# Altium project Tramdo.PrjPcb
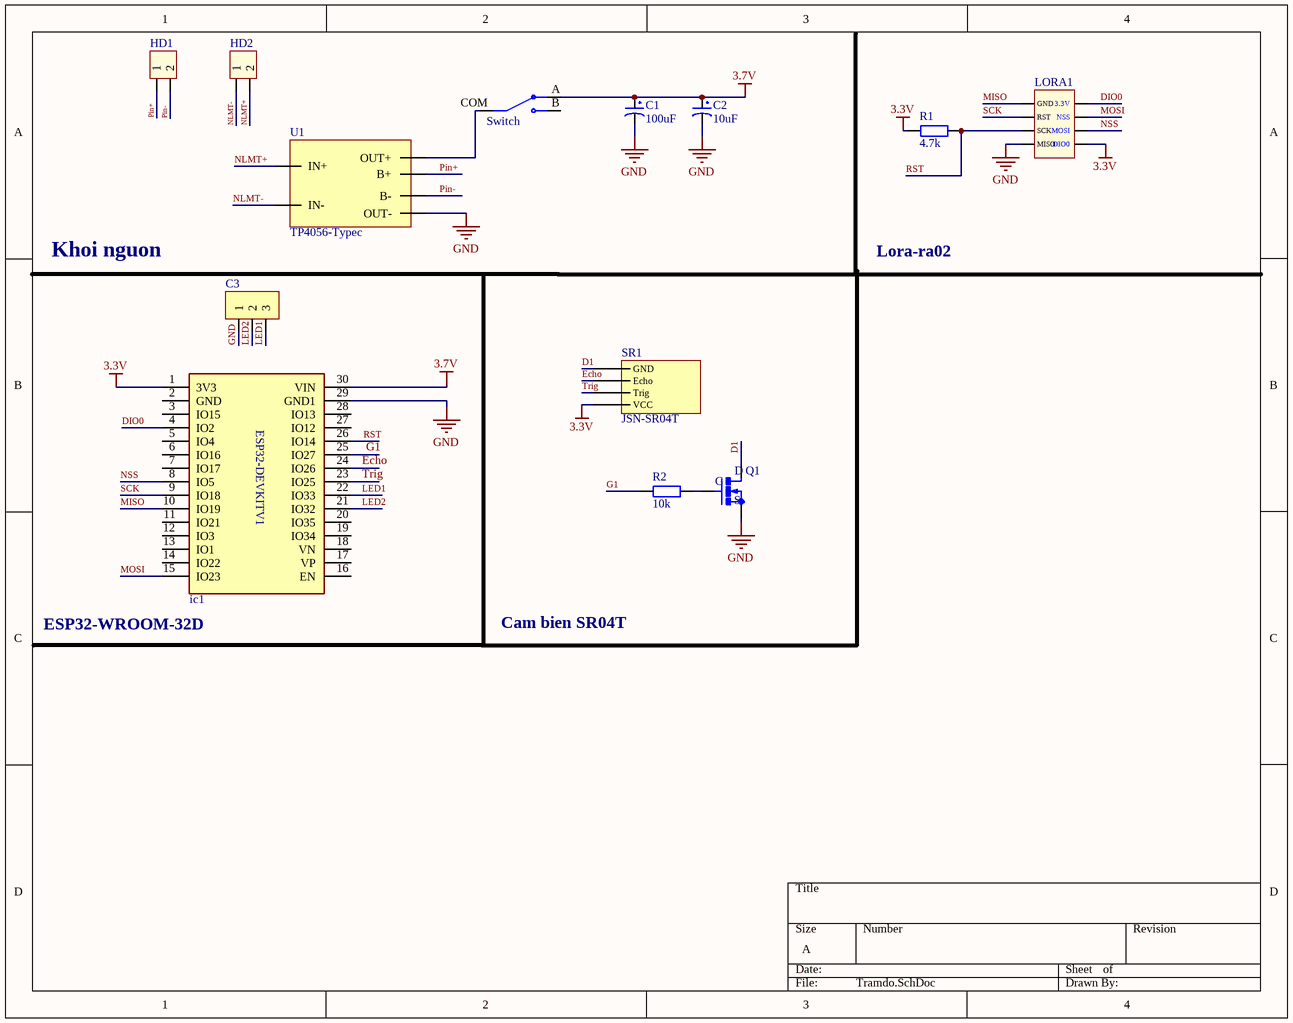
[diagram p0: Tramdo.SchDoc]
1 sheet, 13 parts. Net scope: global (net labels, ports and power ports of the same name join across sheets).
Board file: Tramdo.PcbDoc

## Sheet Tramdo.SchDoc
size A; SheetNumber: 1; SheetTotal: 1

### Parts
C1  100uF  [tu hoa 5mm]
C2  10uF  [tu hoa 4mm]
C3  JP3  [JP3-C1T]  (value not drawn)
HD1  Header 2  [HED2]  (value not drawn)
HD2  Header 2  [HED2]  (value not drawn)
ic1  ESP32 DevKit 30Pin  [ESP32 DevKit V1 30Pin CAo]  (value not drawn)
LORA1  Connector 4x2  [Lora-ra02]  (value not drawn)
Q1  2N7000  [TO92]  (value not drawn)
R1  4.7k  [tro vach 1/4w]
R2  10k  [tro vach 1/4w]
S1  Switch  [SW_R1966ABLKBLKFR]
SR1  JSN-SR04T  [JSN-SR04T]
U1  TP4056-Typec  [TP4056]

### Nets
3.3V: ic1.1(3V3) LORA1.8(DIO0) R1.1 SR1.VCC
3.7V: C1.1 C2.1 ic1.30(VIN) S1.A(6A)
GND: C1.2 C2.2 C3.1 ic1.29(GND1) LORA1.4(MISO) Q1.1(S) U1.OUT-
D1: Q1.3(D) SR1.GND
DIO0: ic1.4(IO2) LORA1.5(3.3V)
Echo: ic1.24(IO26) SR1.Echo
G1: ic1.25(IO27) R2.1
LED1: C3.3 ic1.22(IO33)
LED2: C3.2 ic1.21(IO32)
MISO: ic1.10(IO19) LORA1.1(GND)
MOSI: ic1.15(IO23) LORA1.6(NSS)
NLMT+: HD2.2 U1.IN+
NLMT-: HD2.1 U1.IN-
NSS: ic1.8(IO5) LORA1.7(MOSI)
Pin+: HD1.1 U1.B+
Pin-: HD1.2 U1.B-
RST: ic1.26(IO14) LORA1.3(SCK) R1.2
SCK: ic1.9(IO18) LORA1.2(RST)
Trig: ic1.23(IO25) SR1.Trig
NetQ1_2: Q1.2(G) R2.2
NetS1_COM: S1.COM U1.OUT+

Not connected (* = marked no-connect by the designer): ic1 2(GND) 3(IO15) 5(IO4) 6(IO16) 7(IO17) 11(IO21) 12(IO3) 13(IO1) 14(IO22) 16(EN) 17(VP) 18(VN) 19(IO34) 20(IO35) 27(IO12) 28(IO13); S1 B(6A)

### Notes on the sheet
- Khoi nguon
- Lora-ra02
- (near ic1) ESP32-WROOM-32D
- Cam bien SR04T
- (in symbol ESP32 DevKit 30Pin) ESP32-DEVKITV1

### Library data of the parts
C1 = Tu Hoa 100uF 16V 5x11: Cắm; Don_Vi: Con; So_Chan: 2; Ten_Linh_Kien: Tụ Hóa 100uF 16V 5x11MM; Ma_Hang: MH008417; Chung_Loai: Cắm; Kieu_Chan: *
C2 = Tu Hoa 10uF 16V 4x7: Cắm; So_Chan: 2; Don_Vi: Con; Ten_Linh_Kien: Tụ Hóa 10uF 16V; Ma_Hang: MH006855; Chung_Loai: Cắm; Kieu_Chan: *
C3 = JP3: WR-PHD 2.54 mm Angled Socket Header; Manufacturer: W¨¹rth Elektronik eiSos GmbH; partNo: 613003143121; ComponentLink1 Description: Manufacturer; ComponentLink2 Description: Datasheet; NoPins: 03; Created Date: 29 March 2013; ComponentLink1URL: http://www.we-online.com; ComponentLink2URL: http://katalog.we-online.de/em/datasheet/6130xx143121.pdf; Created by: Karrer Zheng
HD1 HD2 = Hed2: Header 2 (Green); Value: Header 2
LORA1 = LORA-Ra-02: Value: Connector 4x2
Q1 = 2N7000: N-Channel 60 V 200mA (Ta) 400mW (Ta) Through Hole TO-92-3; MF: onsemi; SnapEDA_Link: https://www.snapeda.com/parts/2N7000/Onsemi/view-part/?ref=snap; Package: E-PKG AXIAL-LEADED-2 ON Semiconductor; Value: *; MP: 2N7000; Check_prices: https://www.snapeda.com/parts/2N7000/Onsemi/view-part/?ref=eda
R1 = Tro Vach 1/4W 1% 4.7k: Cắm; Don_Vi: Con; So_Chan: 2; Ten_Linh_Kien: Trở Vạch 1/4w 1% 4.7k; Ma_Hang: MH006350; Chung_Loai: Cắm; Kieu_Chan: *
R2 = Tro Vach 1/4W 1% 10k: Cắm; Don_Vi: Con; So_Chan: 2; Ten_Linh_Kien: Trở Vạch 1/4w 1% 10k; Ma_Hang: MH006349; Chung_Loai: Cắm; Kieu_Chan: *
S1 = R1966ABLKBLKFR: Rocker Switch,R1966 Series,SPST,ON-OFF,Concave,Black,I/O, 15A, 125VAC,R/A P | E-Switch R1966ABLKBLKFR; SnapEDA_Link: https://www.snapeda.com/parts/R1966ABLKBLKFR/E-Switch/view-part/?ref=snap; Package: None; Value: *; MF: E-Switch; MP: R1966ABLKBLKFR; Check_prices: https://www.snapeda.com/parts/R1966ABLKBLKFR/E-Switch/view-part/?ref=eda
SR1 = JSN-SR04T: Sensor sieu am